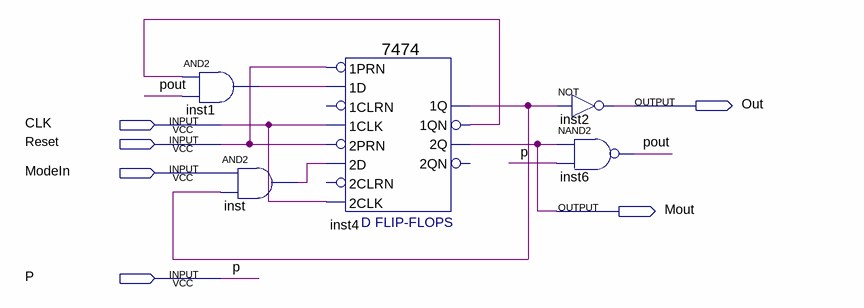
[diagram p0: schematic sheet]
// Quartus schematic Counter1.bdf as structural Verilog: 5 symbols, 6 pins
module Counter1 (
  input  CLK,
  input  Reset,
  input  ModeIn,
  input  P,
  output Out,
  output Mout
);

  wire inst1_out, inst4_1q, inst4_1qn, inst_out, pout;

  and inst1 (inst1_out, inst4_1qn, pout);
  and inst (inst_out, ModeIn, inst4_1q);
  \7474  inst4 (
    .\2D (inst_out), .\2PRN (Reset), .\1CLK (CLK), .\1D (inst1_out), .\1PRN (Reset), .\2CLK (CLK),
    .\1QN (inst4_1qn), .\2Q (Mout), .\1Q (inst4_1q));  // open: 2CLRN, 1CLRN, 2QN
  not inst2 (Out, inst4_1q);
  nand inst6 (pout, Mout, P);
endmodule
